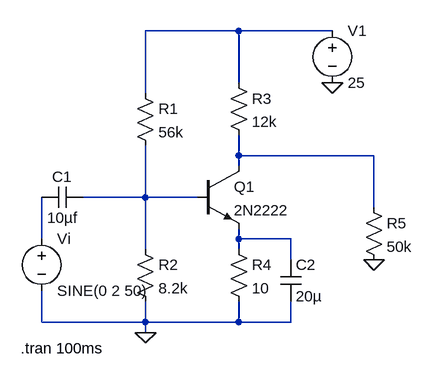
[diagram p0: schematic project.asc]
project.asc, the LTspice schematic file:
Version 4.1
SHEET 1 1000 680
WIRE 240 -80 96 -80
WIRE 384 -80 240 -80
WIRE 240 0 240 -80
WIRE 96 16 96 -80
WIRE 240 112 240 80
WIRE 448 112 240 112
WIRE 240 128 240 112
WIRE 96 176 96 96
WIRE 96 176 0 176
WIRE 176 176 96 176
WIRE 448 192 448 112
WIRE -64 240 -64 176
WIRE 240 240 240 224
WIRE 320 240 240 240
WIRE 96 256 96 176
WIRE 240 256 240 240
WIRE 320 272 320 240
WIRE -64 368 -64 320
WIRE 96 368 96 336
WIRE 96 368 -64 368
WIRE 240 368 240 336
WIRE 240 368 96 368
WIRE 320 368 320 336
WIRE 320 368 240 368
WIRE 96 384 96 368
FLAG 96 384 0
FLAG 384 0 0
FLAG 448 272 0
SYMBOL npn 176 128 R0
SYMATTR InstName Q1
SYMATTR Value 2N2222
SYMBOL res 80 0 R0
SYMATTR InstName R1
SYMATTR Value 56k
SYMBOL res 80 240 R0
SYMATTR InstName R2
SYMATTR Value 8.2k
SYMBOL cap 0 160 R90
WINDOW 0 0 32 VBottom 2
WINDOW 3 32 32 VTop 2
SYMATTR InstName C1
SYMATTR Value 10µf
SYMBOL voltage -64 224 R0
WINDOW 123 0 0 Left 0
WINDOW 39 0 0 Left 0
SYMATTR InstName Vi
SYMATTR Value SINE(0 2 50)
SYMBOL res 224 -16 R0
SYMATTR InstName R3
SYMATTR Value 12k
SYMBOL res 224 240 R0
SYMATTR InstName R4
SYMATTR Value 10
SYMBOL cap 304 272 R0
SYMATTR InstName C2
SYMATTR Value 20µ
SYMBOL voltage 384 -96 R0
WINDOW 123 0 0 Left 0
WINDOW 39 0 0 Left 0
SYMATTR InstName V1
SYMATTR Value 25
SYMBOL res 432 176 R0
SYMATTR InstName R5
SYMATTR Value 50k
TEXT -96 408 Left 2 !.tran 100ms

The netlist it stands for:
* project.asc
Q1 N002 N003 N005 0 2N2222
R1 N001 N003 56k
R2 N003 0 8.2k
C1 N003 N004 10µf
Vi N004 0 SINE(0 2 50)
R3 N001 N002 12k
R4 N005 0 10
C2 N005 0 20µ
V1 N001 0 25
R5 N002 0 50k
.model NPN NPN
.model PNP PNP
.lib standard.bjt
.tran 100ms
.backanno
.end